# Altium schematic sheet AMC.SchDoc: Title
size 420 x 297 mm; Author: G.Kasprowicz; CompanyName: WUT ISE; DrawnBy: G.Kasprowicz; Organization: WUT ISE; Address1: PW ISE; Address2: Nowowiejska 15/19 00-665 Warsaw; Address3: gkasprow@gmail.com; DocumentNumber: 17; Revision: 2; SheetNumber: 17; SheetTotal: 18; ModifiedBy: -; CheckedDate: -; Title2: Title 2; DivGrp: WUT ISE; Designer: G.Kasprowicz; ModifiedDate: -; ProjectName: Sensor Box
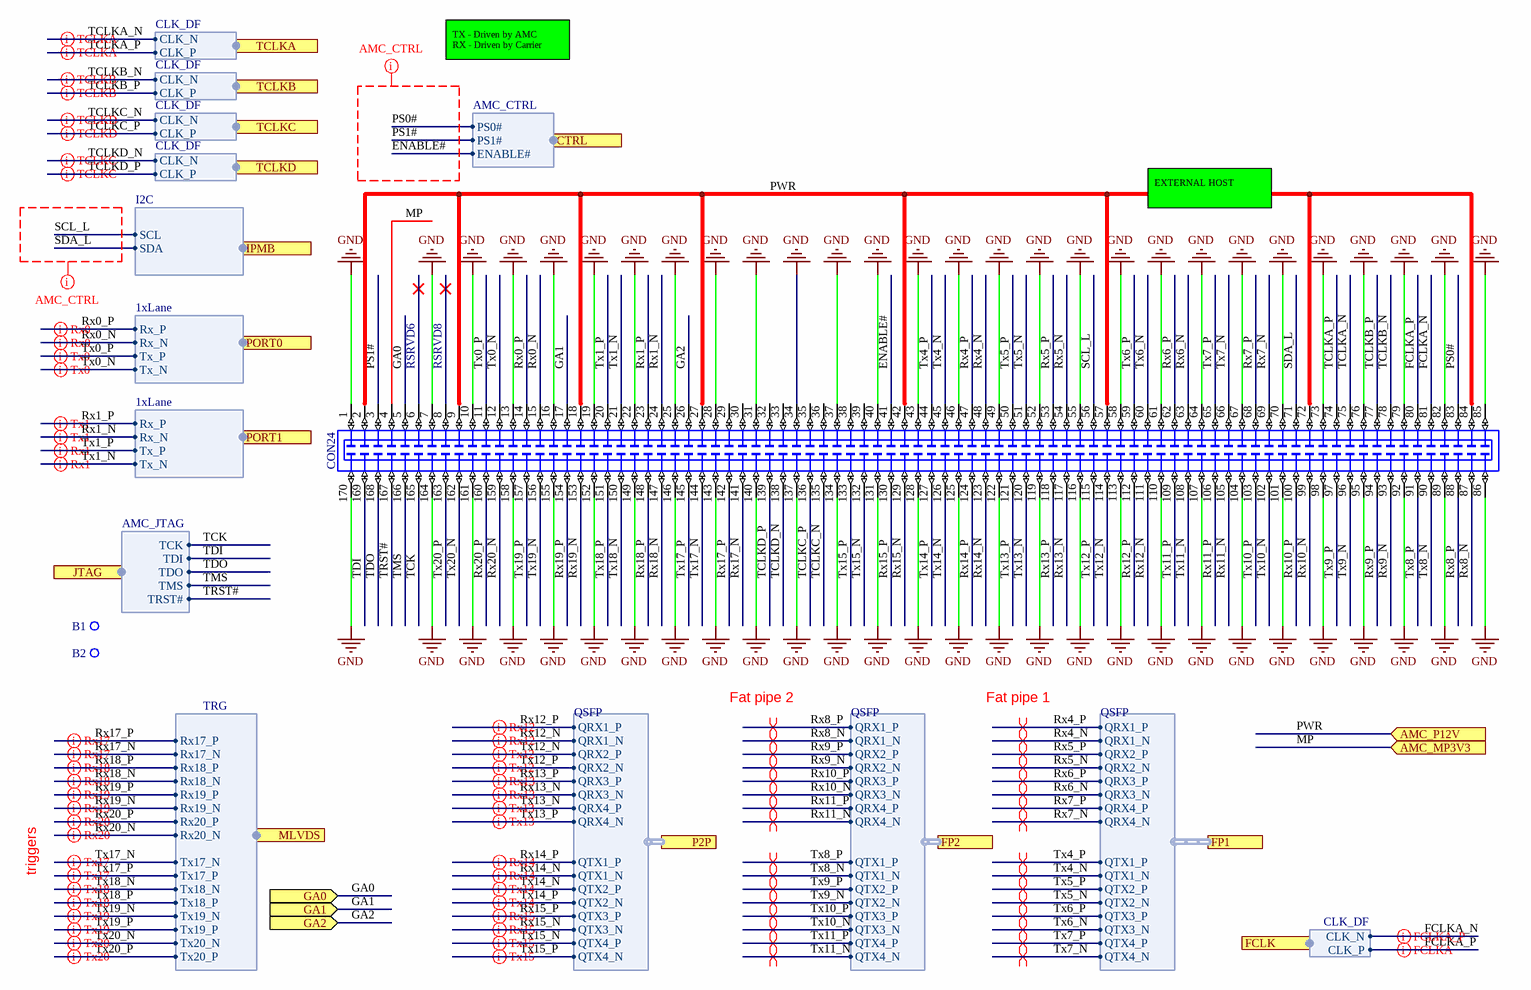
[diagram p0: AMC.SchDoc]

## Parts
B1  Plated Hole  [MTG320_550]  (value not drawn)
B2  Plated Hole  [MTG320_550]  (value not drawn)
CON24  SAMTEC_MTCA-085-02-S-DV-SMT-K-TR  [SAMTEC_MTCA-085-02-S-DV-SMT-K-TR]  (value not drawn)

## Ports
AMC_MP3V3 (in), AMC_P12V (in), CTRL (harness AMC_CTRL), FCLK (harness CLK_DF), FP1 (harness QSFP), FP2 (harness QSFP), GA0 (in), GA1 (in), GA2 (in), IPMB (harness I2C), JTAG (harness AMC_JTAG), MLVDS (harness TRG), P2P (harness QSFP), PORT0 (harness 1xLane), PORT1 (harness 1xLane), TCLKA (harness CLK_DF), TCLKB (harness CLK_DF), TCLKC (harness CLK_DF), TCLKD (harness CLK_DF)

## Harnesses
TRG: Rx17_P, Rx17_N, Rx18_P, Rx18_N, Rx19_P, Rx19_N, Rx20_P, Rx20_N, Tx17_N, Tx17_P, Tx18_N, Tx18_P, Tx19_N, Tx19_P, Tx20_N, Tx20_P
1xLane: Rx_P, Rx_N, Tx_P, Tx_N
I2C: SCL, SDA
CLK_DF: CLK_P, CLK_N
AMC_CTRL: PS0#, PS1#, ENABLE#
AMC_JTAG: TCK, TDI, TDO, TMS, TRST#
QSFP: QRX1_P, QRX1_N, QRX2_P, QRX2_N, QRX3_P, QRX3_N, QRX4_P, QRX4_N, QTX1_P, QTX1_N, QTX2_P, QTX2_N, QTX3_P, QTX3_N, QTX4_P, QTX4_N

## Nets
GND: CON24.1 CON24.7 CON24.10 CON24.13 CON24.16 CON24.19 CON24.22 CON24.25 CON24.28 CON24.31 CON24.34 CON24.37 CON24.40 CON24.43 CON24.46 CON24.49 CON24.52 CON24.55 CON24.58 CON24.61 CON24.64 CON24.67 CON24.70 CON24.73 CON24.76 CON24.79 CON24.82 CON24.85 CON24.86 CON24.89 CON24.92 CON24.95 CON24.98 CON24.101 CON24.104 CON24.107 CON24.110 CON24.113 CON24.116 CON24.119 CON24.122 CON24.125 CON24.128 CON24.131 CON24.134 CON24.137 CON24.140 CON24.143 CON24.146 CON24.149 CON24.152 CON24.155 CON24.158 CON24.161 CON24.164 CON24.170
ENABLE#: CON24.41 ; port CTRL.ENABLE#
FCLKA_N: CON24.81 ; port FCLK.CLK_N
FCLKA_P: CON24.80 ; port FCLK.CLK_P
GA0: CON24.5 ; port GA0
GA1: CON24.17 ; port GA1
GA2: CON24.26 ; port GA2
MP: CON24.4 ; port AMC_MP3V3
PS0#: CON24.83 ; port CTRL.PS0#
PS1#: CON24.3 ; port CTRL.PS1#
PWR: CON24.2 CON24.9 CON24.18 CON24.27 CON24.42 CON24.57 CON24.72 CON24.84 ; port AMC_P12V
Rx0_N: CON24.15 ; port PORT0.Rx_N
Rx0_P: CON24.14 ; port PORT0.Rx_P
Rx1_N: CON24.24 ; port PORT1.Rx_N
Rx1_P: CON24.23 ; port PORT1.Rx_P
Rx4_N: CON24.48 ; port FP1.QRX1_N
Rx4_P: CON24.47 ; port FP1.QRX1_P
Rx5_N: CON24.54 ; port FP1.QRX2_N
Rx5_P: CON24.53 ; port FP1.QRX2_P
Rx6_N: CON24.63 ; port FP1.QRX3_N
Rx6_P: CON24.62 ; port FP1.QRX3_P
Rx7_N: CON24.69 ; port FP1.QRX4_N
Rx7_P: CON24.68 ; port FP1.QRX4_P
Rx8_N: CON24.87 ; port FP2.QRX1_N
Rx8_P: CON24.88 ; port FP2.QRX1_P
Rx9_N: CON24.93 ; port FP2.QRX2_N
Rx9_P: CON24.94 ; port FP2.QRX2_P
Rx10_N: CON24.99 ; port FP2.QRX3_N
Rx10_P: CON24.100 ; port FP2.QRX3_P
Rx11_N: CON24.105 ; port FP2.QRX4_N
Rx11_P: CON24.106 ; port FP2.QRX4_P
Rx12_N: CON24.111 ; port P2P.QRX1_N
Rx12_P: CON24.112 ; port P2P.QRX1_P
Rx13_N: CON24.117 ; port P2P.QRX3_N
Rx13_P: CON24.118 ; port P2P.QRX3_P
Rx14_N: CON24.123 ; port P2P.QTX1_N
Rx14_P: CON24.124 ; port P2P.QTX1_P
Rx15_N: CON24.129 ; port P2P.QTX3_N
Rx15_P: CON24.130 ; port P2P.QTX3_P
Rx17_N: CON24.141 ; port MLVDS.Rx17_N
Rx17_P: CON24.142 ; port MLVDS.Rx17_P
Rx18_N: CON24.147 ; port MLVDS.Rx18_N
Rx18_P: CON24.148 ; port MLVDS.Rx18_P
Rx19_N: CON24.153 ; port MLVDS.Rx19_N
Rx19_P: CON24.154 ; port MLVDS.Rx19_P
Rx20_N: CON24.159 ; port MLVDS.Rx20_N
Rx20_P: CON24.160 ; port MLVDS.Rx20_P
SCL_L: CON24.56 ; port IPMB.SCL
SDA_L: CON24.71 ; port IPMB.SDA
TCK: CON24.165 ; port JTAG.TCK
TCLKA_N: CON24.75 ; port TCLKA.CLK_N
TCLKA_P: CON24.74 ; port TCLKA.CLK_P
TCLKB_N: CON24.78 ; port TCLKB.CLK_N
TCLKB_P: CON24.77 ; port TCLKB.CLK_P
TCLKC_N: CON24.135 ; port TCLKC.CLK_N
TCLKC_P: CON24.136 ; port TCLKC.CLK_P
TCLKD_N: CON24.138 ; port TCLKD.CLK_N
TCLKD_P: CON24.139 ; port TCLKD.CLK_P
TDI: CON24.169 ; port JTAG.TDI
TDO: CON24.168 ; port JTAG.TDO
TMS: CON24.166 ; port JTAG.TMS
TRST#: CON24.167 ; port JTAG.TRST#
Tx0_N: CON24.12 ; port PORT0.Tx_N
Tx0_P: CON24.11 ; port PORT0.Tx_P
Tx1_N: CON24.21 ; port PORT1.Tx_N
Tx1_P: CON24.20 ; port PORT1.Tx_P
Tx4_N: CON24.45 ; port FP1.QTX1_N
Tx4_P: CON24.44 ; port FP1.QTX1_P
Tx5_N: CON24.51 ; port FP1.QTX2_N
Tx5_P: CON24.50 ; port FP1.QTX2_P
Tx6_N: CON24.60 ; port FP1.QTX3_N
Tx6_P: CON24.59 ; port FP1.QTX3_P
Tx7_N: CON24.66 ; port FP1.QTX4_N
Tx7_P: CON24.65 ; port FP1.QTX4_P
Tx8_N: CON24.90 ; port FP2.QTX1_N
Tx8_P: CON24.91 ; port FP2.QTX1_P
Tx9_N: CON24.96 ; port FP2.QTX2_N
Tx9_P: CON24.97 ; port FP2.QTX2_P
Tx10_N: CON24.102 ; port FP2.QTX3_N
Tx10_P: CON24.103 ; port FP2.QTX3_P
Tx11_N: CON24.108 ; port FP2.QTX4_N
Tx11_P: CON24.109 ; port FP2.QTX4_P
Tx12_N: CON24.114 ; port P2P.QRX2_P
Tx12_P: CON24.115 ; port P2P.QRX2_N
Tx13_N: CON24.120 ; port P2P.QRX4_P
Tx13_P: CON24.121 ; port P2P.QRX4_N
Tx14_N: CON24.126 ; port P2P.QTX2_P
Tx14_P: CON24.127 ; port P2P.QTX2_N
Tx15_N: CON24.132 ; port P2P.QTX4_P
Tx15_P: CON24.133 ; port P2P.QTX4_N
Tx17_N: CON24.144 ; port MLVDS.Tx17_N
Tx17_P: CON24.145 ; port MLVDS.Tx17_P
Tx18_N: CON24.150 ; port MLVDS.Tx18_N
Tx18_P: CON24.151 ; port MLVDS.Tx18_P
Tx19_N: CON24.156 ; port MLVDS.Tx19_N
Tx19_P: CON24.157 ; port MLVDS.Tx19_P
Tx20_N: CON24.162 ; port MLVDS.Tx20_N
Tx20_P: CON24.163 ; port MLVDS.Tx20_P

Not connected (* = marked no-connect by the designer): B1 1; B2 1; CON24 6* 8* 29 30 32 33 35 36 38 39

## Layout directives
differential pair: FCLKA_N, FCLKA_P, Rx0_N, Rx0_P, Rx1_N, Rx1_P, Rx4_N, Rx4_P, Rx5_N, Rx5_P, Rx6_N, Rx6_P, Rx7_N, Rx7_P, Rx8_N, Rx8_P, Rx9_N, Rx9_P, Rx10_N, Rx10_P, Rx11_N, Rx11_P, Rx12_N, Rx12_P, Rx13_N, Rx13_P, Rx14_N, Rx14_P, Rx15_N, Rx15_P, Rx17_N, Rx17_P, Rx18_N, Rx18_P, Rx19_N, Rx19_P, Rx20_N, Rx20_P, TCLKA_N, TCLKA_P, TCLKB_N, TCLKB_P, TCLKC_N, TCLKC_P, TCLKD_N, TCLKD_P, Tx0_N, Tx0_P, Tx1_N, Tx1_P, Tx4_N, Tx4_P, Tx5_N, Tx5_P, Tx6_N, Tx6_P, Tx7_N, Tx7_P, Tx8_N, Tx8_P, Tx9_N, Tx9_P, Tx10_N, Tx10_P, Tx11_N, Tx11_P, Tx12_N, Tx12_P, Tx13_N, Tx13_P, Tx14_N, Tx14_P, Tx15_N, Tx15_P, Tx17_N, Tx17_P, Tx18_N, Tx18_P, Tx19_N, Tx19_P, Tx20_N, Tx20_P
net class AMC_CTRL: ENABLE#, PS0#, PS1#, SCL_L, SDA_L

## Notes on the sheet
- TX - Driven by AMC
  RX - Driven by Carrier
- EXTERNAL HOST
- RSRVD6
- RSRVD8
- Fat pipe 2
- Fat pipe 1
- triggers
- Project/Equipment
- Document
- Designer
- Drawn by
- Check.by
- Copyright WUT ISE 2020.
  This documentation describes Open Hardware and is licensed under the CERN OHL v.1.2. You may redistribute and modify this documentation under the terms of the CERN OHL v.1.2. (http://ohwr.org/CERNOHL). This documentation is distributed WITHOUT ANY EXPRESS OR IMPLIED WARRANTY, INCLUDING OF MERCHANTABILITY, SATISFACTORY QUALITY AND FITNESS FOR A PARTICULAR PURPOSE. Please see the CERN OHL v.1.2 for applicable conditions.
- Contact
- File
- Last Mod.
- Print Date
- Sheet
- Size
- A3
- of
- Rev

## Library data of the parts
B1 B2 = PLATED_HOLE3.2_PAD5.5: Single Terminal Socket; Part Description: Plated Through Hole: Hole Dia.=3.2mm Pad Dia.=5.5mm; Mounted: No; Part Number: PLATED_HOLE3.2_PAD5.5; Component Kind: Standard (No BOM); Component Type: Standard (No BOM); Pin Count: 1; Family: Plated Hole; Socket: No; SMD: No; Sense: No; Status: None; ComponentHeight: 0mm; HelpURL: Undefined; Author: CERN DEM JMW; CreateDate: 01.10.2012; LatestRevisionDate: 01.10.2012; PackageDescription: Plated Through Hole: Hole Dia.=3.2mm Pad Dia.=5.5mm
CON24 = SAMTEC_MTCA-085-02-S-DV-SMT-K-TR: 170 Poles,  Micro TCA (Telecom Computing Architecture) Edge Card Socket; Part Description: 170 Poles, Pitch 0.75mm, Micro TCA (Telecom Computing Architecture) Edge Card Socket; Manufacturer: SAMTEC; Part Number: SAMTEC_MTCA-085-02-S-DV-SMT-K-TR; Component Kind: Standard; Component Type: Standard; Pin Count: 170; Mounted: Yes; Socket: No; SMD: Yes; Status: None; Manufacturer Part Number: MTCA-085-02-S-DV-SMT-K-TR; ComponentHeight: 12.85mm; HelpURL: \\cern.ch\dfs\Applications\Altium\Datasheets\SAMTEC_MTCA-085-02-S-DV-SMT-K-TR.pdf; Author: CERN DEM JLC; CreateDate: 2012-08-15; LatestRevisionDate: 2012-08-15; Table: SAMTEC